# Altium schematic sheet POWER.SchDoc
size A4
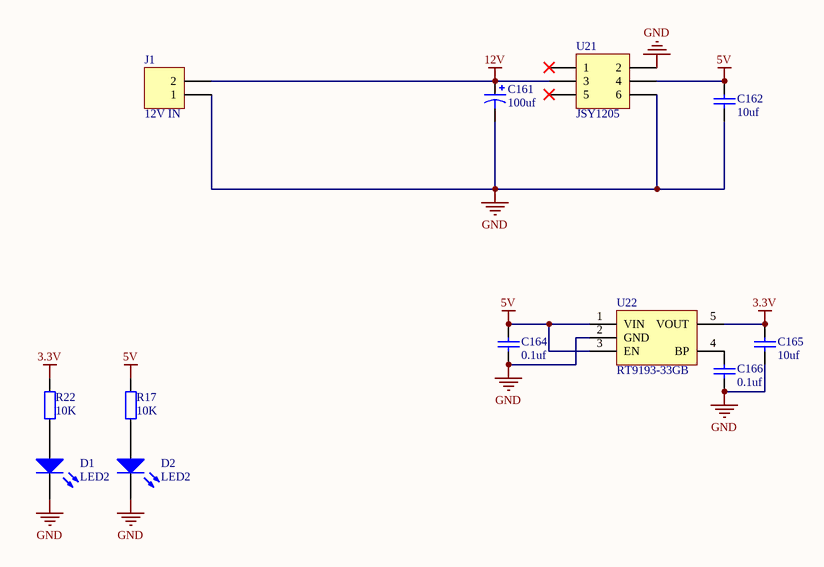
[diagram p0: POWER.SchDoc]

## Parts
C161  100uf  [7343C]
C162  10uf  [0805C]
C164  0.1uf  [0805C]
C165  10uf  [0805C]
C166  0.1uf  [0805C]
D1  LED2  [LED-0805]
D2  LED2  [LED-0805]
J1  12V IN  [VH3.96*2]
R17  10K  [0805R]
R22  10K  [0805R]
U21  JSY1205  [JSY_1205]
U22  RT9193-33GB  [SOT-23-5L]

## Nets
3.3V: C165.2 R22.2 U22.5(VOUT)
5V: C162.2 C164.2 R17.2 U21.4 U22.1(VIN) U22.3(EN)
12V: C161.1 J1.2 U21.3
GND: C161.2 C162.1 C164.1 C165.1 C166.1 D1.2(K) D2.2(K) J1.1 U21.2 U21.6 U22.2(GND)
NetC166_2: C166.2 U22.4(BP)
NetD1_1: D1.1(A) R22.1
NetD2_1: D2.1(A) R17.1

Not connected (* = marked no-connect by the designer): U21 1* 5*

## Library data of the parts
C161 = Cap Pol1: Polarized Capacitor (Radial); Published: 8-Jun-2000; LatestRevisionDate: 17-Jul-2002; LatestRevisionNote: Re-released for DXP Platform.; PackageReference: RB7.6-15; Publisher: Altium Limited; PackageDescription: Polarized Capacitor (Radial); 2 Leads
C162 C165 C166 = Cap: Capacitor; Published: 8-Jun-2000; LatestRevisionDate: 17-Jul-2002; LatestRevisionNote: Re-released for DXP Platform.; PackageReference: RAD-0.3; Publisher: Altium Limited; PackageDescription: Radial Cap, Thru-Hole; 2 Leads; 0.3 in Pin Spacing
C164 = Cap: capacitor; Published: 8-Jun-2000; LatestRevisionDate: 17-Jul-2002; LatestRevisionNote: Re-released for DXP Platform.; PackageReference: RAD-0.3; Publisher: Altium Limited; PackageDescription: Radial Cap, Thru-Hole; 2 Leads; 0.3 in Pin Spacing
D1 D2 = LED2: Typical RED, GREEN, YELLOW, AMBER GaAs LED; Published: 8-Jun-2000; LatestRevisionDate: 17-Jul-2002; LatestRevisionNote: Re-released for DXP Platform.; PackageVersion: Feb-2002; PackageReference: 3.2X1.6X1.1; Publisher: Altium Limited; PackageDescription: SM LED; 2 Flat Leads
J1 = Header 2: Header, 2-Pin; LatestRevisionDate: 17-Jul-2002; LatestRevisionNote: Re-released for DXP Platform.; Publisher: Altium Limited
R17 R22 = Res2: Resistor; Value: 1K; Published: 8-Jun-2000; LatestRevisionDate: 17-Jul-2002; LatestRevisionNote: Re-released for DXP Platform.; PackageReference: AXIAL-0.4; Publisher: Altium Limited; PackageDescription: Axial Device, Thru-Hole; 2 Leads; 0.4 in Pin Spacing
U21 = Header 3X2: Header, 3-Pin, Dual row; LatestRevisionDate: 17-Jul-2002; LatestRevisionNote: Re-released for DXP Platform.; Publisher: Altium Limited
U22 = RT9193: 电源芯片